# Altium schematic sheet Airq_altium.schdoc
size 341 x 288 mm
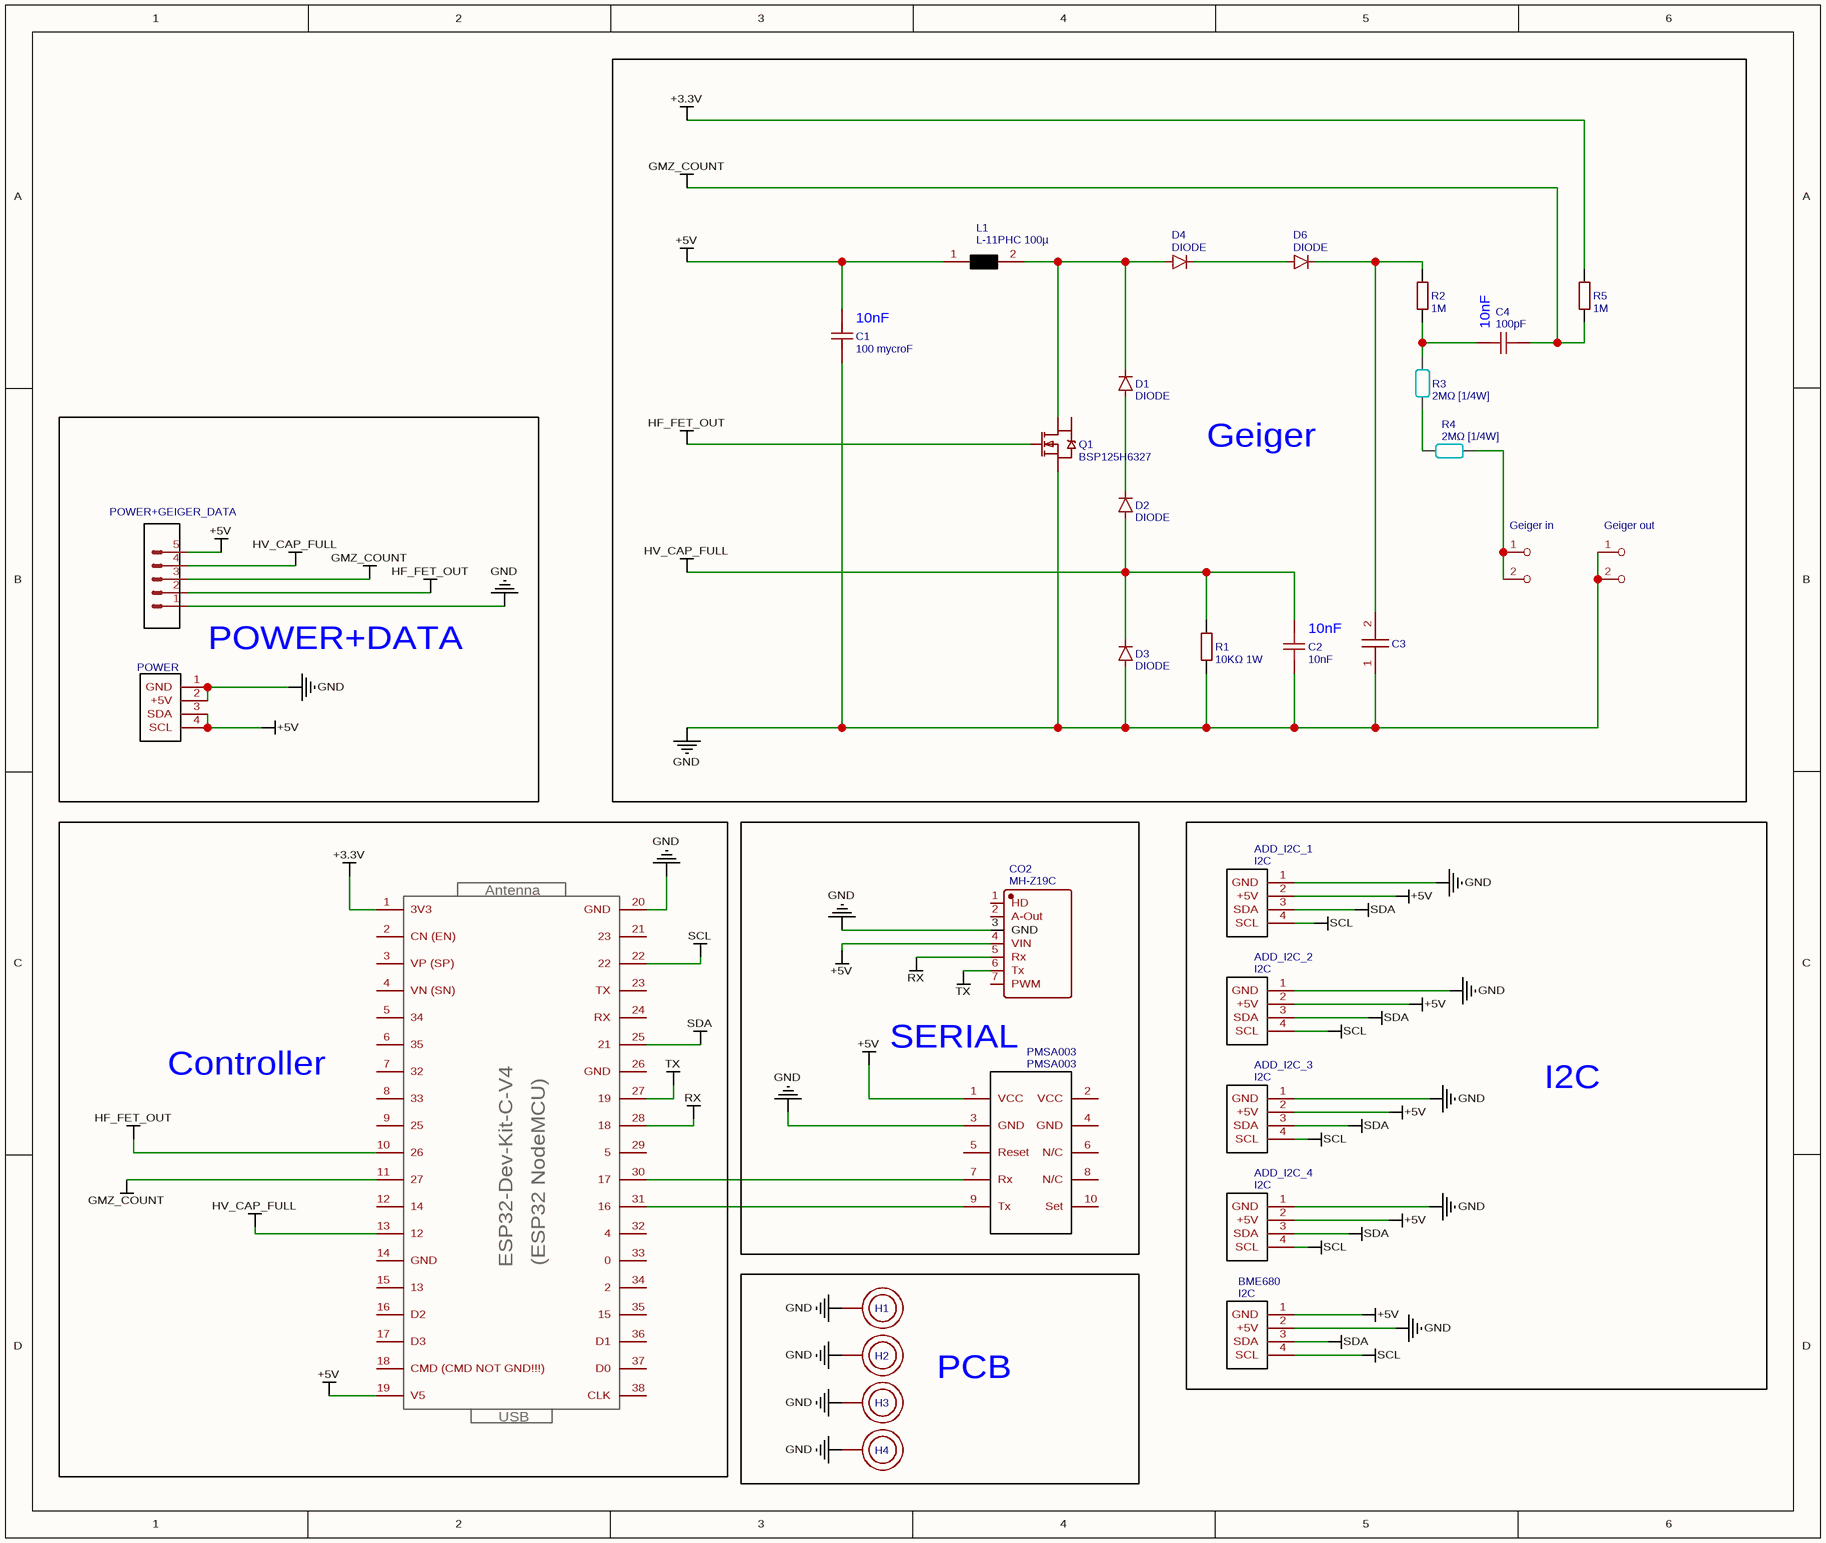
[diagram p0: Airq_altium.schdoc]

## Parts
ADD_I2C_1  I2C  [HDR-M-2.54_1X4]
ADD_I2C_2  I2C  [HDR-M-2.54_1X4]
ADD_I2C_3  I2C  [HDR-M-2.54_1X4]
ADD_I2C_4  I2C  [HDR-M-2.54_1X4]
BME680  I2C  [HDR-M-2.54_1X4]
C1  100 mycroF  [10NF]
C2  10nF  [10NF]
C3  Wima, MKP4, 100nF, 630V  [WIMA,_MKP4,_100NF,_630V]  (value not drawn)
C4  100pF  [10NF]
CO2  MH-Z19C  [MH-Z19C]
D1  DIODE  [DIODE-1N4148-KIT]
D2  DIODE  [DIODE-1N4148-KIT]
D3  DIODE  [DIODE-1N4148-KIT]
D4  DIODE  [DIODE-1N4148-KIT]
D6  DIODE  [DIODE-1N4148-KIT]
H1  HoleHole  [HOLEHOLE]  (value not drawn)
H2  HoleHole  [HOLEHOLE]  (value not drawn)
H3  HoleHole  [HOLEHOLE]  (value not drawn)
H4  HoleHole  [HOLEHOLE]  (value not drawn)
JP1  Geiger in  [HDR1X2]
JP2  Geiger out  [HDR1X2]
L1  L-11PHC 100µ  [11PHC-RM5-12D]
PMSA003  PMSA003  [PMSA003]
POWER  Power  [HDR-M-2.54_1X4]  (value not drawn)
POWER+GEIGER_DATA  POWER+GEIGER_DATA  [5 PIN HEADER]
Q1  BSP125H6327  [SOT-223-4_L6.5-W3.5-P2.30-LS7.0-BR]
R1  10KΩ 1W  [RES-TH_BD2.5-L6.5-P10.50-D0.6]
R2  1M  [RES-TH_BD2.5-L6.5-P10.50-D0.6]
R3  2MΩ [1/4W]  [RC-TH_1/4W[1/2WS]]
R4  2MΩ [1/4W]  [RC-TH_1/4W[1/2WS]]
R5  1M  [RES-TH_BD2.5-L6.5-P10.50-D0.6]
U1  AZDelivery_ESP32_NodeMCU  [AZ-DELIVERY ESP32 NODEMCU MODULE]  (value not drawn)

## Blocks framed on the sheet
Geiger: C1-C4 D1-D4 D6 JP1 JP2 L1 Q1 R1-R5
POWER+DATA: POWER POWER+GEIGER_DATA
Controller: U1
SERIAL: CO2 PMSA003
I2C: ADD_I2C_1-ADD_I2C_4 BME680
PCB: H1-H4

## Nets
+3.3V: R5.1 U1.1(3V3)
+5V: ADD_I2C_1.2(+5V) ADD_I2C_2.2(+5V) ADD_I2C_3.2(+5V) ADD_I2C_4.2(+5V) BME680.1(GND) C1.2 CO2.4(VIN) L1.1 PMSA003.1(VCC) POWER.3(SDA) POWER.4(SCL) POWER+GEIGER_DATA.5 U1.19(V5)
GMZ_COUNT: C4.1 POWER+GEIGER_DATA.3 R5.2 U1.11(27)
GND: ADD_I2C_1.1(GND) ADD_I2C_2.1(GND) ADD_I2C_3.1(GND) ADD_I2C_4.1(GND) BME680.2(+5V) C1.1 C2.1 C3.1 CO2.3(GND) D3.A H1.1 H2.1 H3.1 H4.1 JP2.1 JP2.2 PMSA003.3(GND) POWER.1(GND) POWER.2(+5V) POWER+GEIGER_DATA.1 Q1.3(S) R1.1 U1.20(GND)
HF_FET_OUT: POWER+GEIGER_DATA.2 Q1.1(G) U1.10(26)
HV_CAP_FULL: C2.2 D2.A D3.C POWER+GEIGER_DATA.4 R1.2 U1.13(12)
RX: CO2.5(Rx) U1.28(18)
SCL: ADD_I2C_1.4(SCL) ADD_I2C_2.4(SCL) ADD_I2C_3.4(SCL) ADD_I2C_4.4(SCL) BME680.4(SCL) U1.22
SDA: ADD_I2C_1.3(SDA) ADD_I2C_2.3(SDA) ADD_I2C_3.3(SDA) ADD_I2C_4.3(SDA) BME680.3(SDA) U1.25(21)
TX: CO2.6(Tx) U1.27(19)
NetC3_2: C3.2 D6.C R2.2
NetC4_2: C4.2 R2.1 R3.2
NetD1_A: D1.A D2.C
NetD1_C: D1.C D4.A L1.2 Q1.2(D)
NetD4_C: D4.C D6.A
NetJP1_1: JP1.1 JP1.2 R4.2
NetPMSA003_7: PMSA003.7(Rx) U1.30(17)
NetPMSA003_9: PMSA003.9(Tx) U1.31(16)
NetR3_1: R3.1 R4.1

Not connected (* = marked no-connect by the designer): CO2 1(HD) 2(A-Out) 7(PWM); PMSA003 2(VCC) 4(GND) 5(Reset) 6(N/C) 8(N/C) 10(Set); Q1 4(D); U1 2(CN_(EN)) 3(VP_(SP)) 4(VN_(SN)) 5(34) 6(35) 7(32) 8(33) 9(25) 12(14) 14(GND) 15(13) 16(D2) 17(D3) 18(CMD_(CMD_NOT_GND!!!)) 21(23) 23(TX) 24(RX) 26(GND) 29(5) 32(4) 33(0) 34(2) 35(15) 36(D1) 37(D0) 38(CLK)

## Notes on the sheet
- (in symbol AZDelivery_ESP32_NodeMCU) Antenna; ESP32-Dev-Kit-C-V4; (ESP32 NodeMCU); USB

## Library data of the parts
ADD_I2C_1-ADD_I2C_4 BME680 = I2C: Contributor: paultwick; spicePre: U; spiceSymbolName: I2C
C1 = 100 mycroF: Contributor: Shant Centistoke; spicePre: U; spiceSymbolName: 10nF
C2 = 10nF: Contributor: Shant Centistoke; spicePre: U; spiceSymbolName: 10nF
C3 = Wima, MKP4, 100nF, 630V: Contributor: Hotte; spicePre: U; spiceSymbolName: Wima, MKP4, 100nF, 630V
C4 = 100pF: Contributor: Shant Centistoke; spicePre: U; spiceSymbolName: 10nF
CO2 = MH-Z19C: BOM_Manufacturer: Winsen; Contributor: Ralf-Michael von Prondzinski; Package Display: No; timeStamp: 1474062548; BOM_Supplier Part: https://github.com/WifWaf/MH-Z19/tree/master/examples/BasicUsage; spicePre: M; spiceSymbolName: MH-Z19C
H1-H4 = HoleHole: Contributor: Cillié Malan; spicePre: H; spiceSymbolName: HoleHole
JP1 = Geiger in: Contributor: Adafruit; sourceId: 0SMGAR9rl; timeStamp: 1457467422; spicePre: J; spiceSymbolName: 2 Pin Header
JP2 = Geiger out: Contributor: Adafruit; sourceId: 0SMGAR9rl; timeStamp: 1457467422; spicePre: J; spiceSymbolName: 2 Pin Header
L1 = L-11PHC 100µ: Contributor: Bagger; link: https://www.reichelt.de/stehende-induktivitaet-11phc-ferrit-100-h-l-11phc-100-p138670.html?&trstct=pol_2; spicePre: U; spiceSymbolName: L-11PHC 100µ
PMSA003 = PMSA003: Contributor: rajsiman; BOM_Manufacturer Part: PMSA003; BOM_Supplier: Plantower; link: http://www.plantower.com/content/?125.html; spicePre: U; spiceSymbolName: PMSA003
POWER = Power: Contributor: paultwick; spicePre: U; spiceSymbolName: I2C
POWER+GEIGER_DATA = POWER+GEIGER_DATA: description: 5 x 0.1 inch Header; Contributor: SparkFun; sourceId: JcMKkUSPp; timeStamp: 1468223677; spicePre: U; spiceSymbolName: Header 5pin
Q1 = BSP125H6327: BOM_Manufacturer: Infineon Technologies; Contributor: LCSC; BOM_Supplier: LCSC; BOM_Supplier Part: C123756; BOM_Manufacturer Part: BSP125H6327; BOM_JLCPCB Part Class: Extended Part; spicePre: Q; spiceSymbolName: BSP125H6327
R1 = 10KΩ 1W: BOM_Manufacturer: UniOhm; BOM_Manufacturer Part: MFR0W4F1004A50; nameAlias: Resistance (Ohms); BOM_Supplier: LCSC; BOM_Supplier Part: C58596; spicePre: R; spiceSymbolName: 1M OHM
R2 R5 = 1M: BOM_Manufacturer: UniOhm; BOM_Manufacturer Part: MFR0W4F1004A50; nameAlias: Resistance (Ohms); BOM_Supplier: LCSC; BOM_Supplier Part: C58596; spicePre: R; spiceSymbolName: 1M OHM
R3 R4 = 2MΩ [1/4W]: Contributor: Harwave Technologies; BOM_Supplier Part: C720290; BOM_Supplier: LCSC; spicePre: R; spiceSymbolName: 4.7MΩ [1/4W]
U1 = AZDelivery_ESP32_NodeMCU: Contributor: Andreas Riepl; spicePre: U; spiceSymbolName: AZDelivery_ESP32_NodeMCU
D1-D4 D6 = DIODE: description: Diode; timeStamp: 1470900487; spicePre: D; spiceSymbolName: DIODE